# Altium schematic sheet EVB-ANNA-B5_SCHEM_0007_mikroE.SchDoc
size A3; DocumentNumber: 6; SheetNumber: 8; SheetTotal: 8
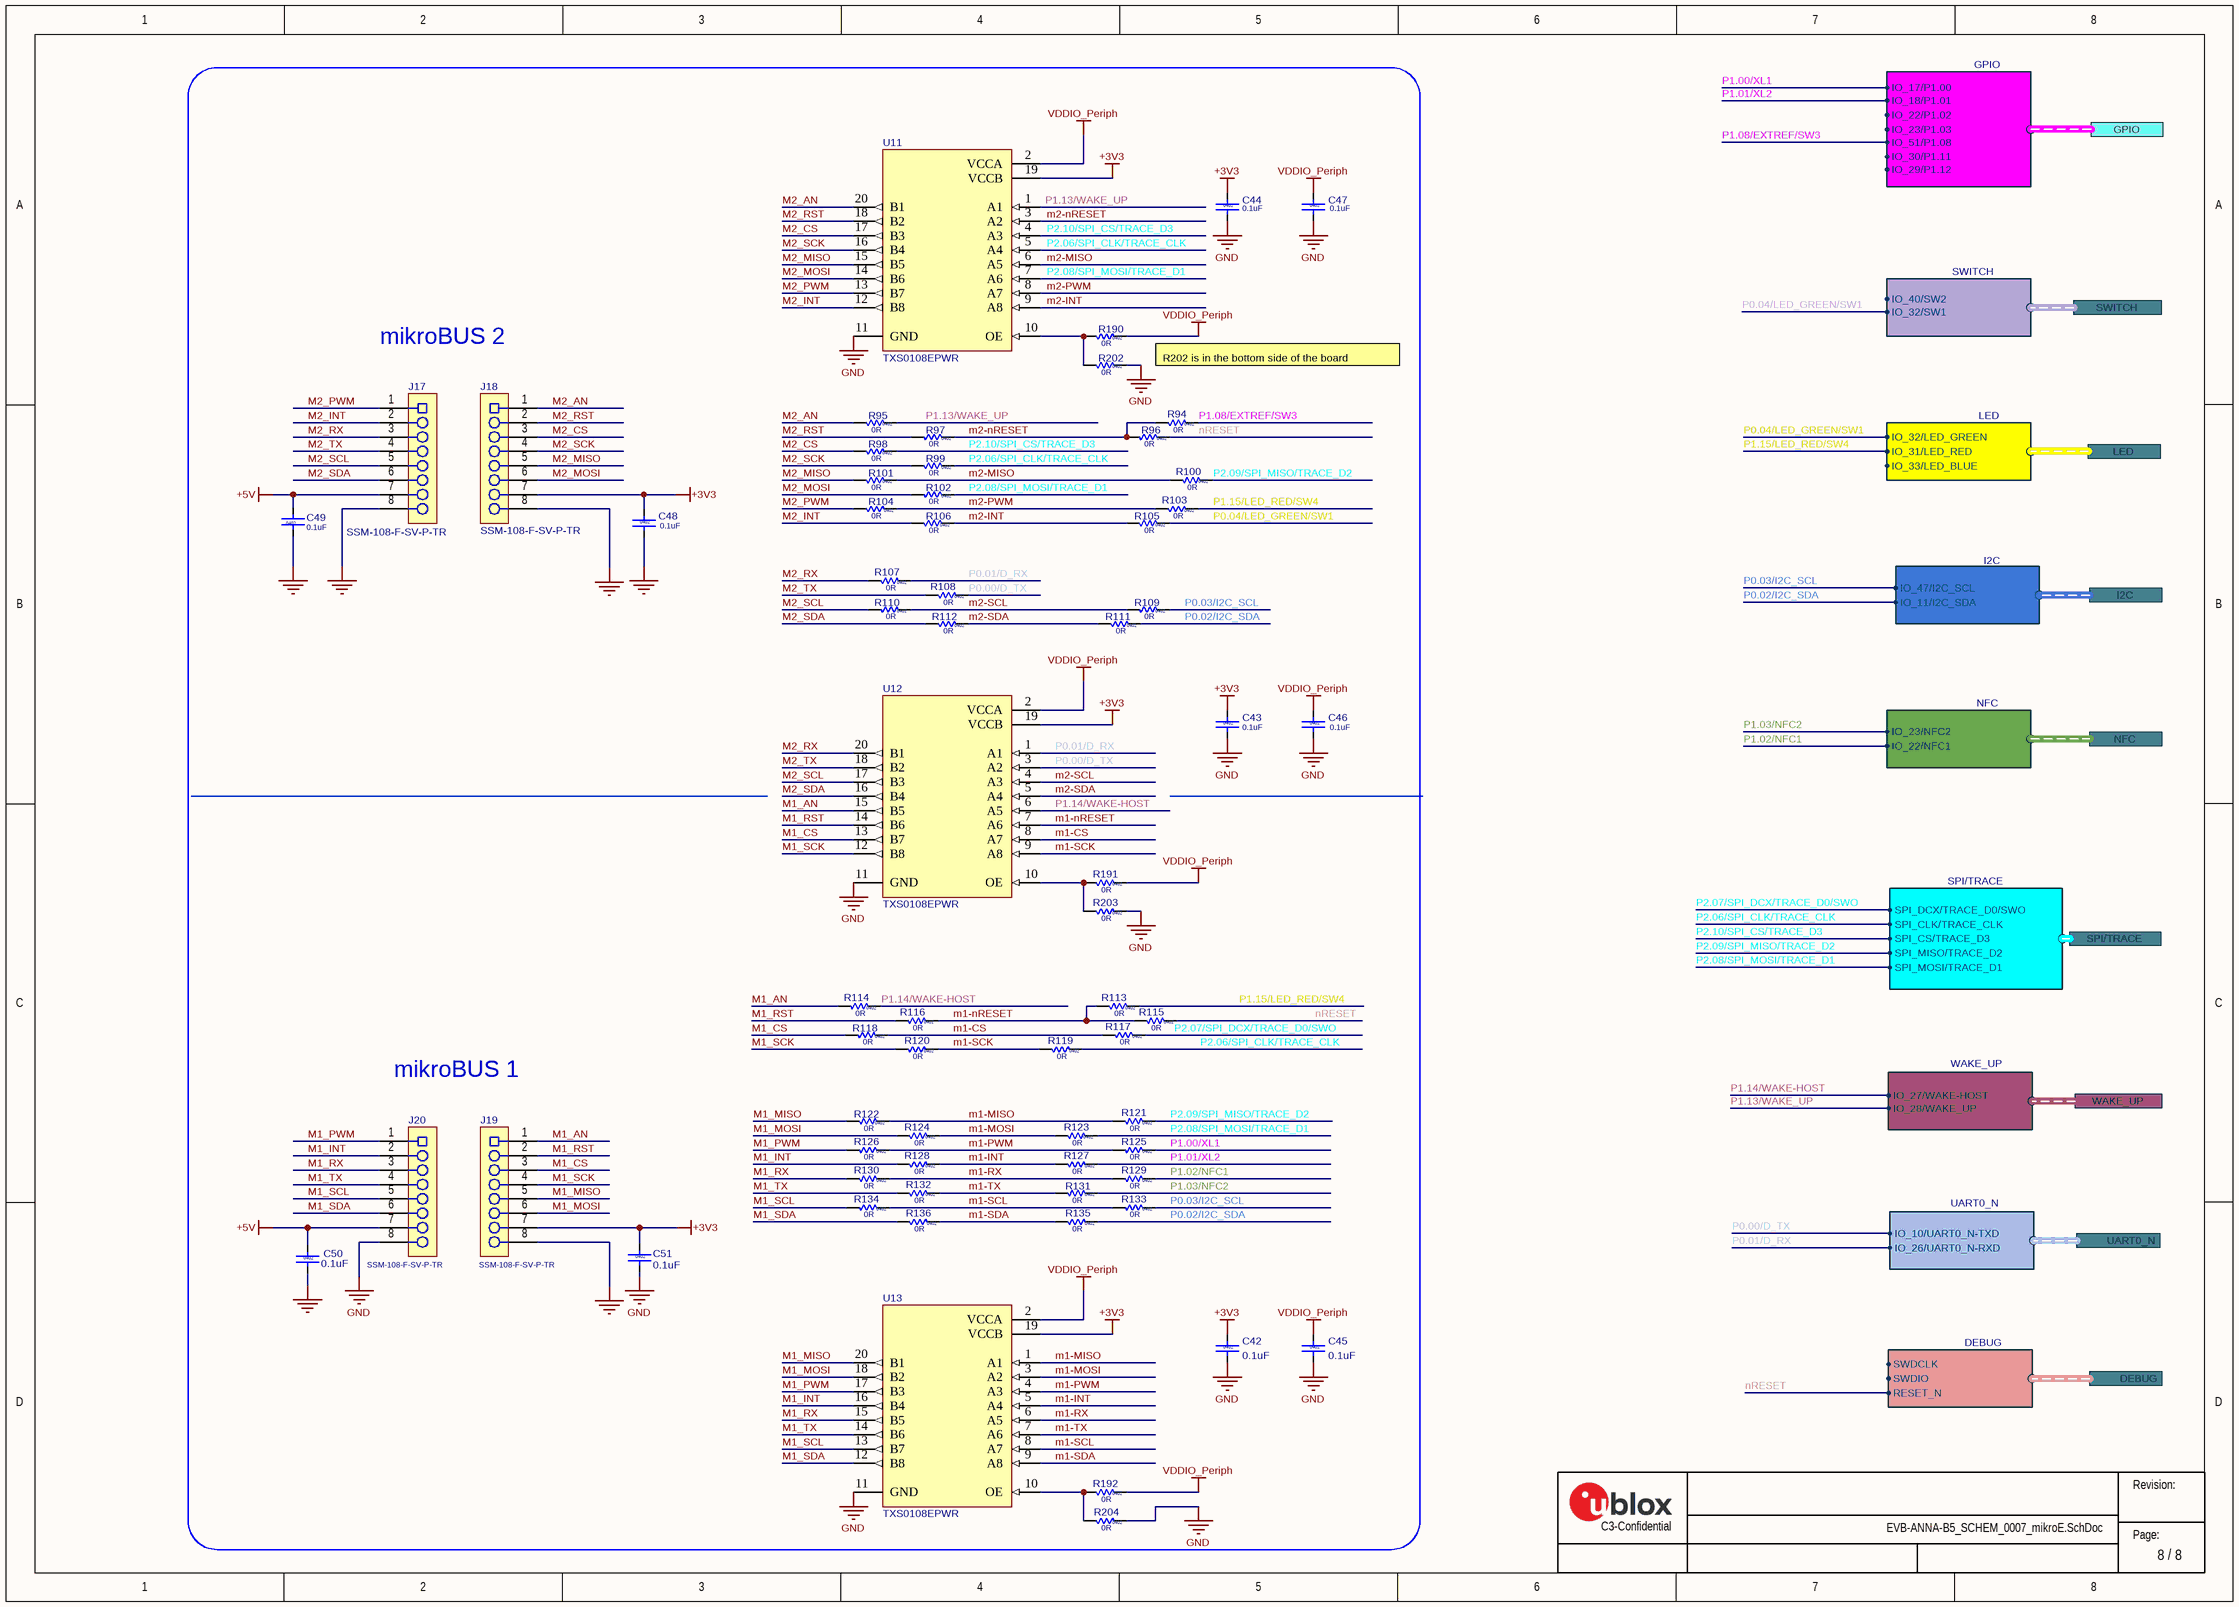
[diagram p0: EVB-ANNA-B5_SCHEM_0007_mikroE.SchDoc]

## Parts
C42  value 0.1uF  Size: 0402  [Cap 0402 HD]  (hidden comment: 120-00016)
C43  value 0.1uF  Size: 0402  [Cap 0402 HD]  (hidden comment: 120-00016)
C44  value 0.1uF  Size: 0402  [Cap 0402 HD]  (hidden comment: 120-00016)
C45  value 0.1uF  Size: 0402  [Cap 0402 HD]  (hidden comment: 120-00016)
C46  value 0.1uF  Size: 0402  [Cap 0402 HD]  (hidden comment: 120-00016)
C47  value 0.1uF  Size: 0402  [Cap 0402 HD]  (hidden comment: 120-00016)
C48  value 0.1uF  Size: 0402  [Cap 0402 HD]  (hidden comment: 120-00016)
C49  value 0.1uF  Size: 0402  [Cap 0402 HD]  (hidden comment: 120-00016)
C50  value 0.1uF  Size: 0402  [Cap 0402 HD]  (hidden comment: 120-00016)
C51  value 0.1uF  Size: 0402  [Cap 0402 HD]  (hidden comment: 120-00016)
J17  Manufacturer Part Number 1: SSM-108-F-SV-P-TR  [SKT-0.1P-SSM-108-L-SV]  (hidden comment: 130-00102)
J18  Manufacturer Part Number 1: SSM-108-F-SV-P-TR  [SKT-0.1P-SSM-108-L-SV]  (hidden comment: 130-00102)
J19  Manufacturer Part Number 1: SSM-108-F-SV-P-TR  [SKT-0.1P-SSM-108-L-SV]  (hidden comment: 130-00102)
J20  Manufacturer Part Number 1: SSM-108-F-SV-P-TR  [SKT-0.1P-SSM-108-L-SV]  (hidden comment: 130-00102)
R94  value 0R  Size: 0402  [RES 0402 HD]  (hidden comment: UBXH18-0003002)
R95  value 0R  Size: 0402  [RES 0402 HD]  (hidden comment: UBXH18-0003002)
R96  value 0R  Size: 0402  [RES 0402 HD]  (hidden comment: UBXH18-0003002)
R97  value 0R  Size: 0402  [RES 0402 HD]  (hidden comment: UBXH18-0003002)
R98  value 0R  Size: 0402  [RES 0402 HD]  (hidden comment: UBXH18-0003002)
R99  value 0R  Size: 0402  [RES 0402 HD]  (hidden comment: UBXH18-0003002)
R100  value 0R  Size: 0402  [RES 0402 HD]  (hidden comment: UBXH18-0003002)
R101  value 0R  Size: 0402  [RES 0402 HD]  (hidden comment: UBXH18-0003002)
R102  value 0R  Size: 0402  [RES 0402 HD]  (hidden comment: UBXH18-0003002)
R103  value 0R  Size: 0402  [RES 0402 HD]  (hidden comment: UBXH18-0003002)
R104  value 0R  Size: 0402  [RES 0402 HD]  (hidden comment: UBXH18-0003002)
R105  value 0R  Size: 0402  [RES 0402 HD]  (hidden comment: UBXH18-0003002)
R106  value 0R  Size: 0402  [RES 0402 HD]  (hidden comment: UBXH18-0003002)
R107  value 0R  Size: 0402  [RES 0402 HD]  (hidden comment: UBXH18-0003002)
R108  value 0R  Size: 0402  [RES 0402 HD]  (hidden comment: UBXH18-0003002)
R109  value 0R  Size: 0402  [RES 0402 HD]  (hidden comment: UBXH18-0003002)
R110  value 0R  Size: 0402  [RES 0402 HD]  (hidden comment: UBXH18-0003002)
R111  value 0R  Size: 0402  [RES 0402 HD]  (hidden comment: UBXH18-0003002)
R112  value 0R  Size: 0402  [RES 0402 HD]  (hidden comment: UBXH18-0003002)
R113  value 0R  Size: 0402  [RES 0402 HD]  (hidden comment: UBXH18-0003002)
R114  value 0R  Size: 0402  [RES 0402 HD]  (hidden comment: UBXH18-0003002)
R115  value 0R  Size: 0402  [RES 0402 HD]  (hidden comment: UBXH18-0003002)
R116  value 0R  Size: 0402  [RES 0402 HD]  (hidden comment: UBXH18-0003002)
R117  value 0R  Size: 0402  [RES 0402 HD]  (hidden comment: UBXH18-0003002)
R118  value 0R  Size: 0402  [RES 0402 HD]  (hidden comment: UBXH18-0003002)
R119  value 0R  Size: 0402  [RES 0402 HD]  (hidden comment: UBXH18-0003002)
R120  value 0R  Size: 0402  [RES 0402 HD]  (hidden comment: UBXH18-0003002)
R121  value 0R  Size: 0402  [RES 0402 HD]  (hidden comment: UBXH18-0003002)
R122  value 0R  Size: 0402  [RES 0402 HD]  (hidden comment: UBXH18-0003002)
R123  value 0R  Size: 0402  [RES 0402 HD]  (hidden comment: UBXH18-0003002)
R124  value 0R  Size: 0402  [RES 0402 HD]  (hidden comment: UBXH18-0003002)
R125  value 0R  Size: 0402  [RES 0402 HD]  (hidden comment: UBXH18-0003002)
R126  value 0R  Size: 0402  [RES 0402 HD]  (hidden comment: UBXH18-0003002)
R127  value 0R  Size: 0402  [RES 0402 HD]  (hidden comment: UBXH18-0003002)
R128  value 0R  Size: 0402  [RES 0402 HD]  (hidden comment: UBXH18-0003002)
R129  value 0R  Size: 0402  [RES 0402 HD]  (hidden comment: UBXH18-0003002)
R130  value 0R  Size: 0402  [RES 0402 HD]  (hidden comment: UBXH18-0003002)
R131  value 0R  Size: 0402  [RES 0402 HD]  (hidden comment: UBXH18-0003002)
R132  value 0R  Size: 0402  [RES 0402 HD]  (hidden comment: UBXH18-0003002)
R133  value 0R  Size: 0402  [RES 0402 HD]  (hidden comment: UBXH18-0003002)
R134  value 0R  Size: 0402  [RES 0402 HD]  (hidden comment: UBXH18-0003002)
R135  value 0R  Size: 0402  [RES 0402 HD]  (hidden comment: UBXH18-0003002)
R136  value 0R  Size: 0402  [RES 0402 HD]  (hidden comment: UBXH18-0003002)
R190  value 0R  Size: 0402  [RES 0402 HD]  (hidden comment: UBXH18-0003002)
R191  value 0R  Size: 0402  [RES 0402 HD]  (hidden comment: UBXH18-0003002)
R192  value 0R  Size: 0402  [RES 0402 HD]  (hidden comment: UBXH18-0003002)
R202  value 0R  Size: 0402  [RES 0402 HD]  (hidden comment: UBXH18-0003002)
R203  value 0R  Size: 0402  [RES 0402 HD]  (hidden comment: UBXH18-0003002)
R204  value 0R  Size: 0402  [RES 0402 HD]  (hidden comment: UBXH18-0003002)
U11  UBXH10-0000036  [TSOP0.65P6.40X1.20-20Pin]  (value not drawn)
U12  UBXH10-0000036  [TSOP0.65P6.40X1.20-20Pin]  (value not drawn)
U13  UBXH10-0000036  [TSOP0.65P6.40X1.20-20Pin]  (value not drawn)

## Ports
DEBUG (harness Debug), GPIO (harness GPIO), I2C (harness I2C), LED (harness LED), NFC (harness NFC), SPI/TRACE (harness SPI/TRACE), SWITCH (harness SWITCH), UART0_N (harness UART0_N), WAKE_UP (harness WAKE_UP)

## Harnesses
LED: IO_33/LED_BLUE, IO_31/LED_RED, IO_32/LED_GREEN
SWITCH: IO_40/SW2, IO_32/SW1
DEBUG: RESET_N, SWDIO, SWDCLK
NFC: IO_23/NFC2, IO_22/NFC1
SPI/TRACE: SPI_DCX/TRACE_D0/SWO, SPI_CLK/TRACE_CLK, SPI_CS/TRACE_D3, SPI_MISO/TRACE_D2, SPI_MOSI/TRACE_D1
GPIO: IO_17/P1.00, IO_18/P1.01, IO_22/P1.02, IO_51/P1.08, IO_23/P1.03, IO_30/P1.11, IO_29/P1.12
UART0_N: IO_10/UART0_N-TXD, IO_26/UART0_N-RXD
I2C: IO_47/I2C_SCL, IO_11/I2C_SDA
WAKE_UP: IO_27/WAKE-HOST, IO_28/WAKE_UP

## Nets
+3V3: C42.1 C43.1 C44.1 C48.1 C51.1 J18.7 J19.7 U11.19(VCCB) U12.19(VCCB) U13.19(VCCB)
+5V: C49.2 C50.1 J17.7 J20.7
GND: C42.2 C43.2 C44.2 C45.2 C46.2 C47.2 C48.2 C49.1 C50.2 C51.2 J17.8 J18.8 J19.8 J20.8 R202.2 R203.2 R204.2 U11.11(GND) U12.11(GND) U13.11(GND)
VDDIO_Periph: C45.1 C46.1 C47.1 R190.2 R191.2 R192.2 U11.2(VCCA) U12.2(VCCA) U13.2(VCCA)
m1-CS: R117.1 R118.2 U12.8(A7)
m1-INT: R127.1 R128.2 U13.5(A4)
m1-MISO: R121.1 R122.2 U13.1(A1)
m1-MOSI: R123.1 R124.2 U13.3(A2)
m1-nRESET: R113.1 R115.1 R116.2 U12.7(A6)
m1-PWM: R125.1 R126.2 U13.4(A3)
m1-RX: R129.1 R130.2 U13.6(A5)
m1-SCK: R119.1 R120.2 U12.9(A8)
m1-SCL: R133.1 R134.2 U13.8(A7)
m1-SDA: R135.1 R136.2 U13.9(A8)
m1-TX: R131.1 R132.2 U13.7(A6)
M1_AN: J19.1 R114.1 U12.15(B5)
M1_CS: J19.3 R118.1 U12.13(B7)
M1_INT: J20.2 R128.1 U13.16(B4)
M1_MISO: J19.5 R122.1 U13.20(B1)
M1_MOSI: J19.6 R124.1 U13.18(B2)
M1_PWM: J20.1 R126.1 U13.17(B3)
M1_RST: J19.2 R116.1 U12.14(B6)
M1_RX: J20.3 R130.1 U13.15(B5)
M1_SCK: J19.4 R120.1 U12.12(B8)
M1_SCL: J20.5 R134.1 U13.13(B7)
M1_SDA: J20.6 R136.1 U13.12(B8)
M1_TX: J20.4 R132.1 U13.14(B6)
m2-INT: R105.1 R106.2 U11.9(A8)
m2-MISO: R100.1 R101.2 U11.6(A5)
m2-nRESET: R94.1 R96.1 R97.2 U11.3(A2)
m2-PWM: R103.1 R104.2 U11.8(A7)
m2-SCL: R109.1 R110.2 U12.4(A3)
m2-SDA: R111.1 R112.2 U12.5(A4)
M2_AN: J18.1 R95.1 U11.20(B1)
M2_CS: J18.3 R98.1 U11.17(B3)
M2_INT: J17.2 R106.1 U11.12(B8)
M2_MISO: J18.5 R101.1 U11.15(B5)
M2_MOSI: J18.6 R102.1 U11.14(B6)
M2_PWM: J17.1 R104.1 U11.13(B7)
M2_RST: J18.2 R97.1 U11.18(B2)
M2_RX: J17.3 R107.1 U12.20(B1)
M2_SCK: J18.4 R99.1 U11.16(B4)
M2_SCL: J17.5 R110.1 U12.17(B3)
M2_SDA: J17.6 R112.1 U12.16(B4)
M2_TX: J17.4 R108.1 U12.18(B2)
nRESET: R96.2 R115.2 ; port DEBUG.RESET_N
P0.00/D_TX: R108.2 U12.3(A2) ; port UART0_N.IO_10/UART0_N-TXD
P0.01/D_RX: R107.2 U12.1(A1) ; port UART0_N.IO_26/UART0_N-RXD
P0.02/I2C_SDA: R111.2 R135.2 ; port I2C.IO_11/I2C_SDA
P0.03/I2C_SCL: R109.2 R133.2 ; port I2C.IO_47/I2C_SCL
P0.04/LED_GREEN/SW1: R105.2 ; port LED.IO_32/LED_GREEN, port SWITCH.IO_32/SW1
P1.00/XL1: R125.2 ; port GPIO.IO_17/P1.00
P1.01/XL2: R127.2 ; port GPIO.IO_18/P1.01
P1.02/NFC1: R129.2 ; port NFC.IO_22/NFC1
P1.03/NFC2: R131.2 ; port NFC.IO_23/NFC2
P1.08/EXTREF/SW3: R94.2 ; port GPIO.IO_51/P1.08
P1.13/WAKE_UP: R95.2 U11.1(A1) ; port WAKE_UP.IO_28/WAKE_UP
P1.14/WAKE-HOST: R114.2 U12.6(A5) ; port WAKE_UP.IO_27/WAKE-HOST
P1.15/LED_RED/SW4: R103.2 R113.2 ; port LED.IO_31/LED_RED
P2.06/SPI_CLK/TRACE_CLK: R99.2 R119.2 U11.5(A4) ; port SPI/TRACE.SPI_CLK/TRACE_CLK
P2.07/SPI_DCX/TRACE_D0/SWO: R117.2 ; port SPI/TRACE.SPI_DCX/TRACE_D0/SWO
P2.08/SPI_MOSI/TRACE_D1: R102.2 R123.2 U11.7(A6) ; port SPI/TRACE.SPI_MOSI/TRACE_D1
P2.09/SPI_MISO/TRACE_D2: R100.2 R121.2 ; port SPI/TRACE.SPI_MISO/TRACE_D2
P2.10/SPI_CS/TRACE_D3: R98.2 U11.4(A3) ; port SPI/TRACE.SPI_CS/TRACE_D3
NetR190_1: R190.1 R202.1 U11.10(OE)
NetR191_1: R191.1 R203.1 U12.10(OE)
NetR192_1: R192.1 R204.1 U13.10(OE)

## Notes on the sheet
- mikroBUS 2
- R202 is in the bottom side of the board
- mikroBUS 1
- Revision:
- C3-Confidential
- Page:

## Library data of the parts
C42-C51 = 120-00016: Cap, Ceramic 0.1uF 10V 10% X5R 0402; Part Name: CAP CER 0.1UF 10V 10% X5R 0402; Part_Type: Ceramic Capacitor; Manufacturer: Murata Electronics North America; Manufacturer P/N: GRM155R61A104KA01J; Item_Phase: Production; Component Mounting Type: SMT; Tolerance: +/- 10%; Use in new designs: Yes; Part Number: 120-00016; Revision: 0A; Supplier 1: Digi-Key; Supplier Part Number 1: 490-6297-1-ND; Manufacturer 2: Yageo; Manufacturer P/N 2: CC0402KRX5R6BB104; Supplier 2: Digi-Key; Supplier Part Number 2: 311-1336-1-ND; Arena Link: https://app.bom.com/a/GYHPV2L2L43KRMBK?v=spec.summary; Height: 0.55mm; Pins: 2; Temperature Coefficient: X5R; Voltage: 10V
J17-J20 = 130-00102: Socket Strip 0.1" 8 Pin 1Row SMD Black; Manufacturer 1: Samtec; Part Name: CON SKT Strip 0.1" 8Pin 1Row SMD Black; Item Phase: In Production; Use in new designs: Yes; Voltage: 572VDC; UBX Code: None; Part Number: 130-00102; Supplier 1: Avnet; Supplier Part Number 1: SSM-108-F-SV-P-TR; Diameter: None; Height: 7.37mm; Max Operating Temp: 105; Min Operating Temp: -55; Pins: 8; Revision: 0D; Manufacturer 2: Sullins Connector Solutions; Manufacturer Part Number 2: NPPC081KFXC-RC; Supplier 2: Digi-Key; Supplier Part Number 2: S5639-ND
R94-R136 R190-R192 R202-R204 = UBXH18-0003002: RES THICK FILM CHIP 0402 0R 0 100mW; Manufacturer: KOA; Manufacturer P/N: RK73Z1ETTP; Tolerance: 0; Editor: charlotte.biber; Released by: peter.mueller; Env: ROHS; Permitted Use: Volume Products; Perferred: PREF; Mfg P/N Status: NRND; Mfg P/N Split: 100; Mfg P/N Released: Yes; Part Number: UBXH18-0003002; Max Power: 100mW; Part Type: Resistor; Release Data: 2012-06-05 09:49:55.978616; UBX Wiki: https://wiki.u-blox.com/bin/view/Operations/PartDetails?index=6611; RefDes: R; Manufacturer 2: YAGEO; Manufacturer P/N 2: 2322_705_91001_L; Mfg P/N Status 2: NRND; Mfg P/N Split 2: 0; Mfg P/N Released 2: Yes
U11-U13 = UBXH10-0000036: TXS0108 8-BIT BIDIRECTIONAL VOLTAGE-LEVEL TRANSLATOR; Manufacturer: Texas Instruments; Value: TXS0108EPWR; Editor: roland.rust; Released by: adam.johansson; Env: GREEN; Permitted Use: Support Products; Perferred: PREF; Mfg P/N Status: Active; Mfg P/N Split: 100; Mfg P/N Released: Yes; Manufacturer P/N: TXS0108EPWR; Part Number: UBXH10-0000036; Min Operating Temp: -40°C; Max Operating Temp: 85°C; Part Type: Interface; Release Data: 2015-06-17T17:08:49; UBX Wiki: https://wiki.u-blox.com/bin/view/Operations/PartDetails?index=22749; RefDes: U; Mfg P/N Datasheet: https://wiki.u-blox.com/bin/view/Generic/Docs/DocumentSummary?index=22748